# EAGLE design main_board (EAGLE 7.7.0)
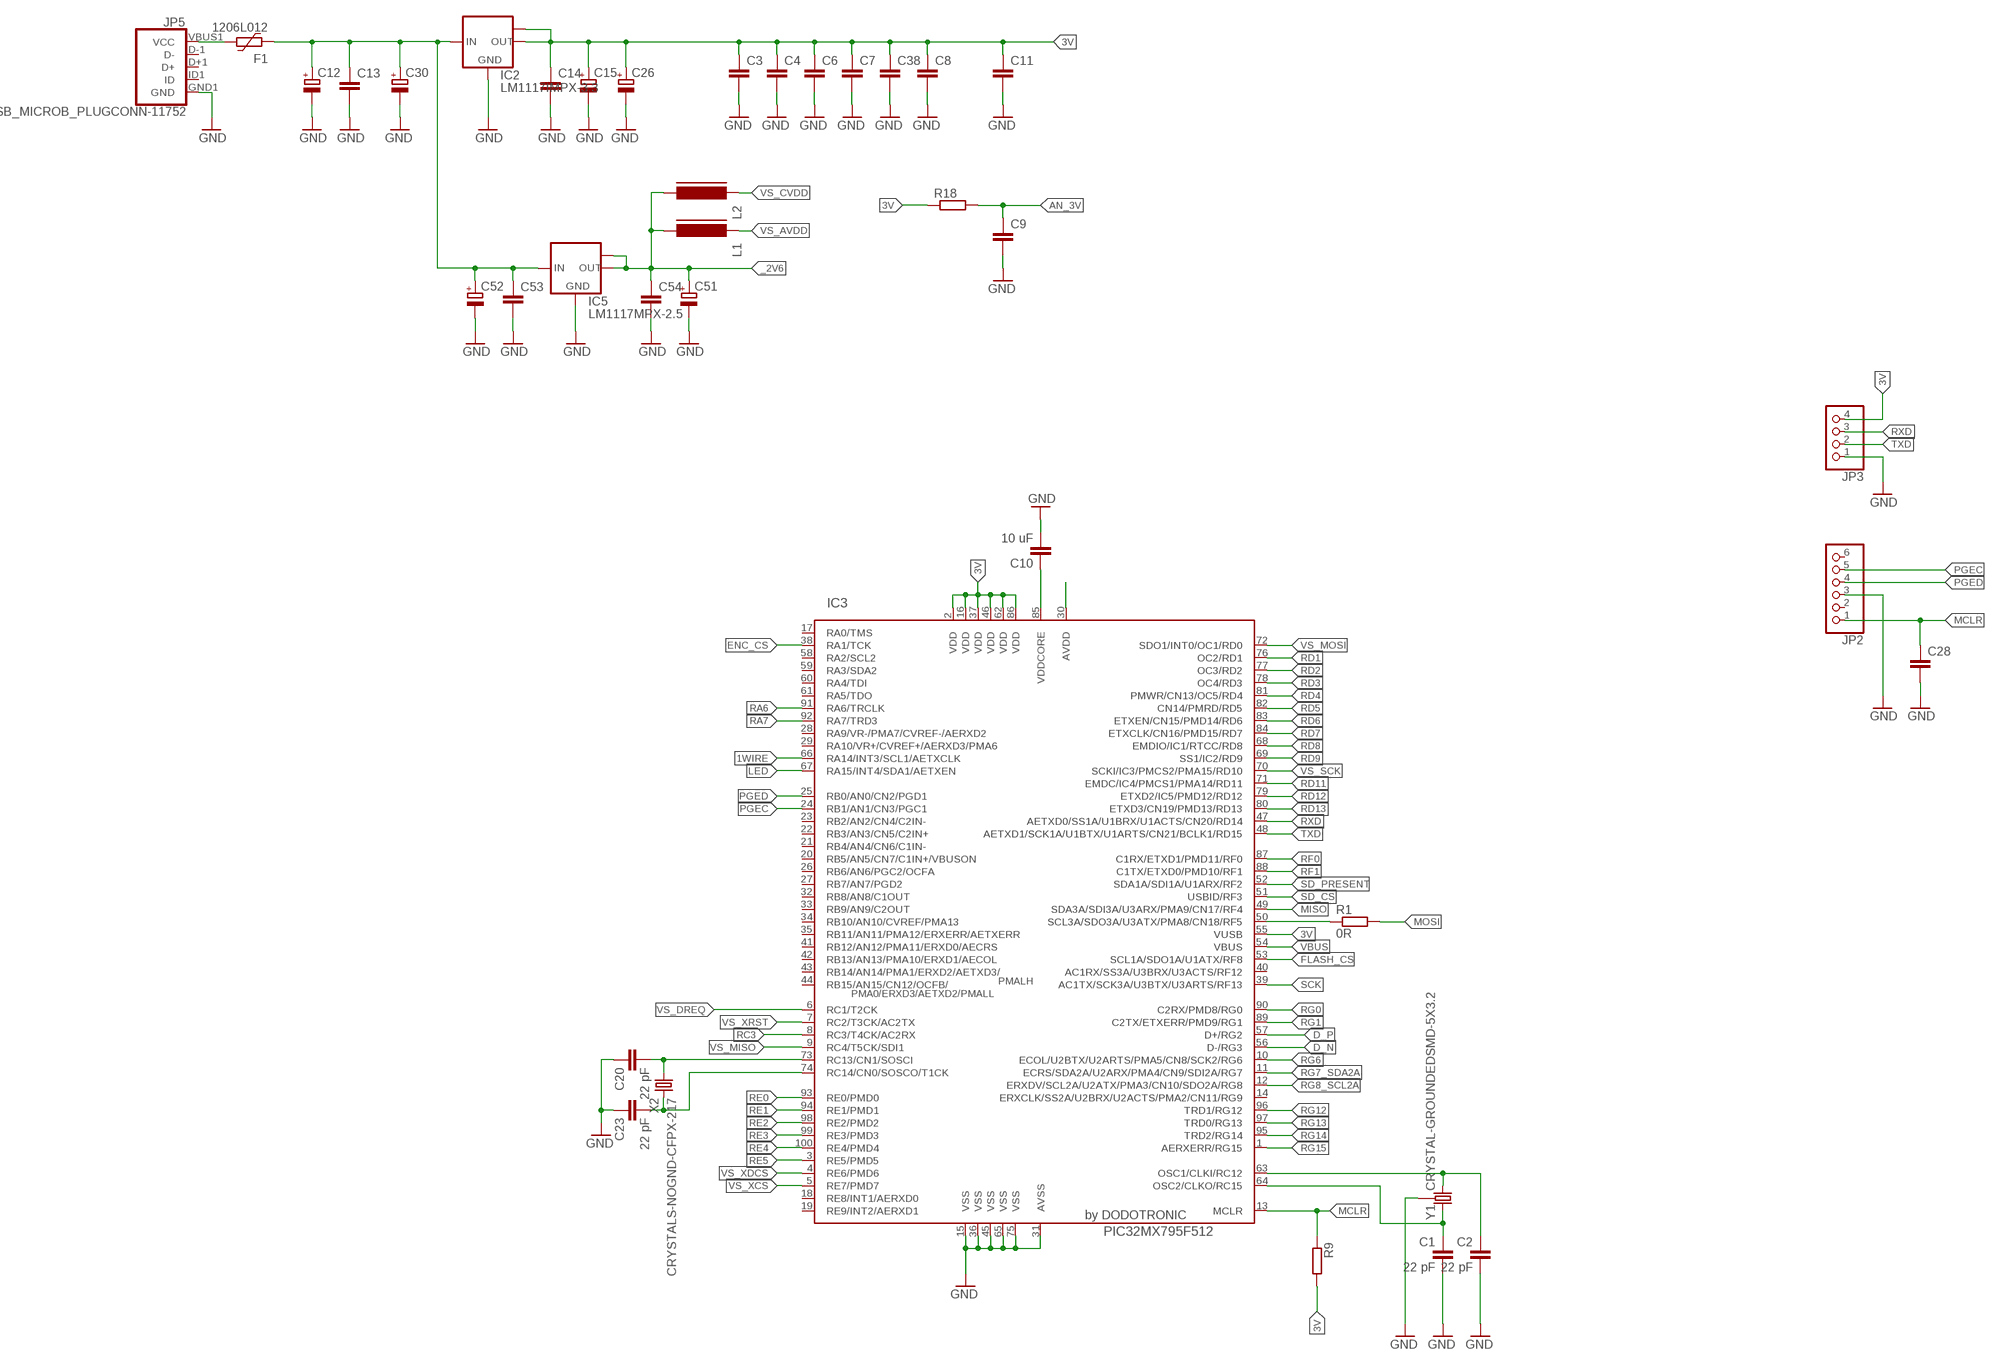
[diagram p0: schematic, sheet 1, part 1 of 3]
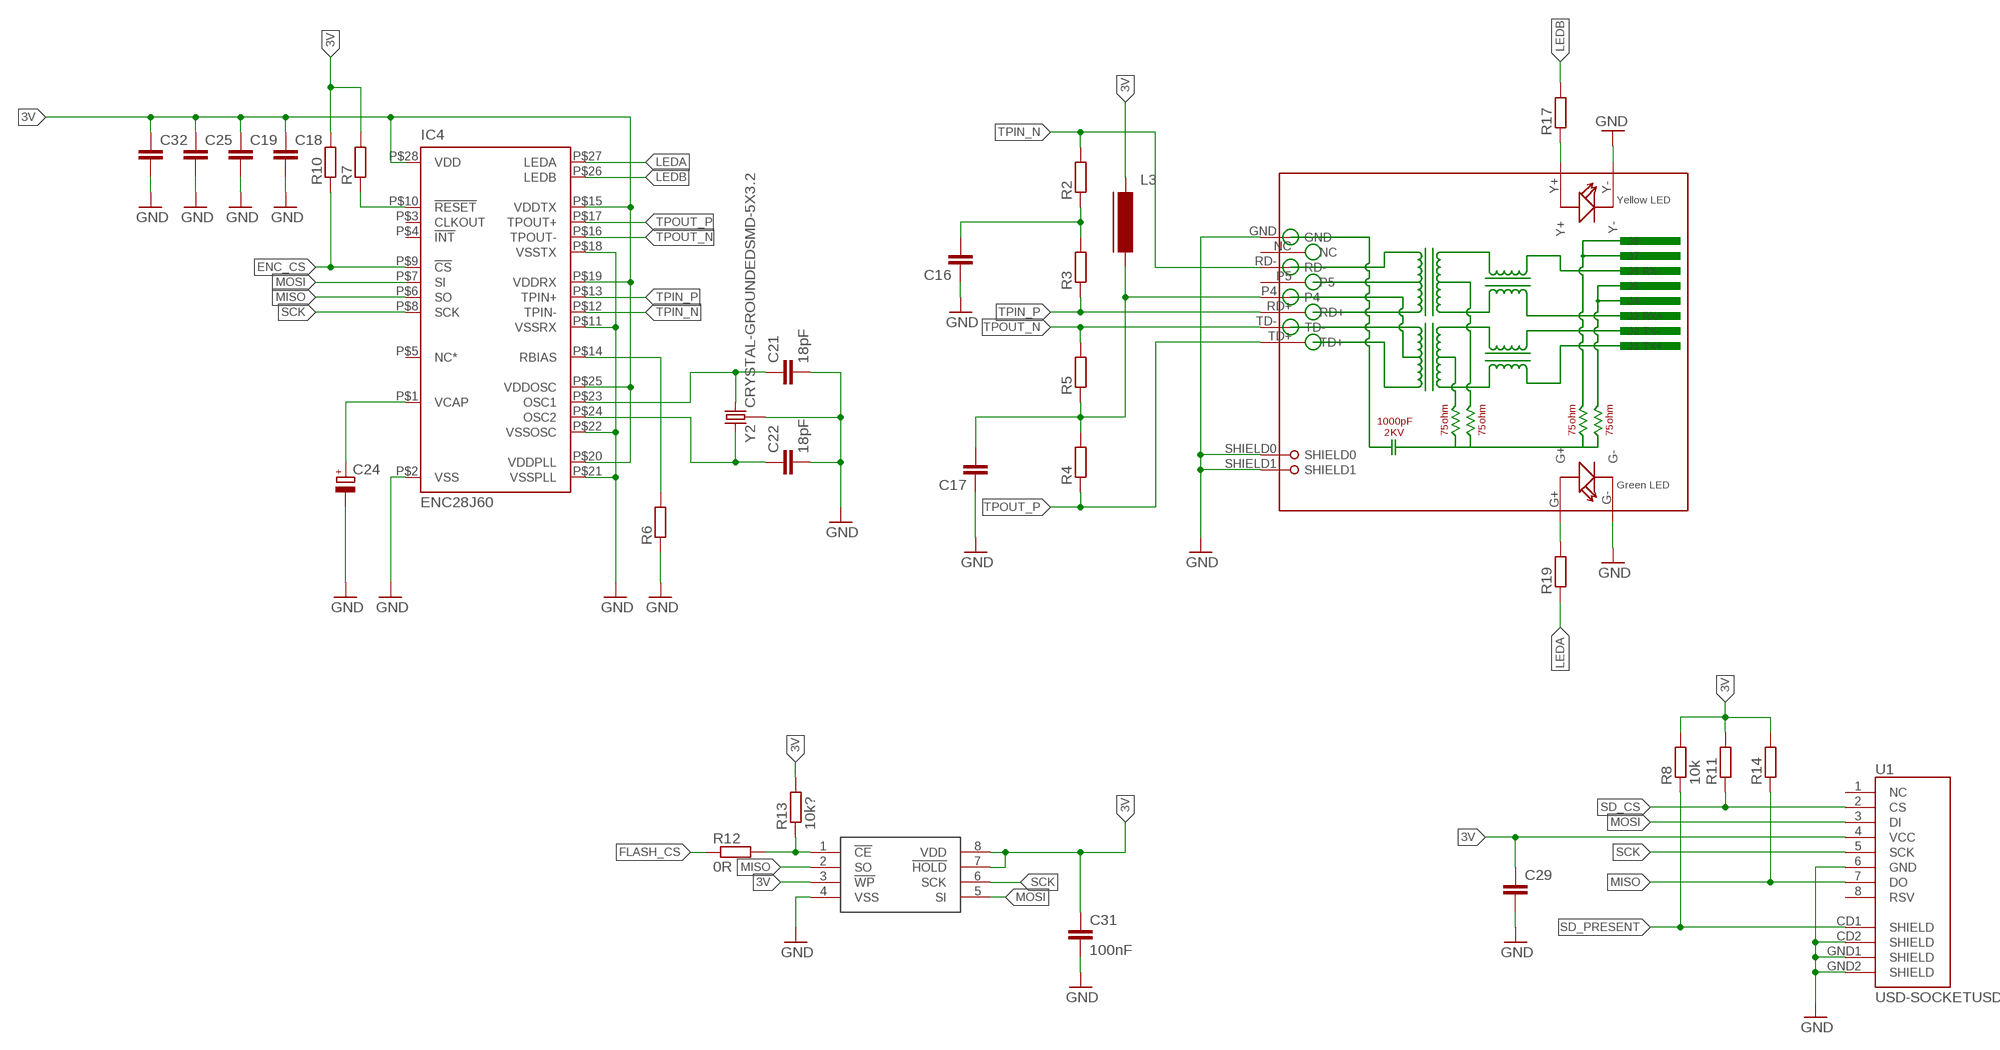
[diagram p1: schematic, sheet 1, part 2 of 3]
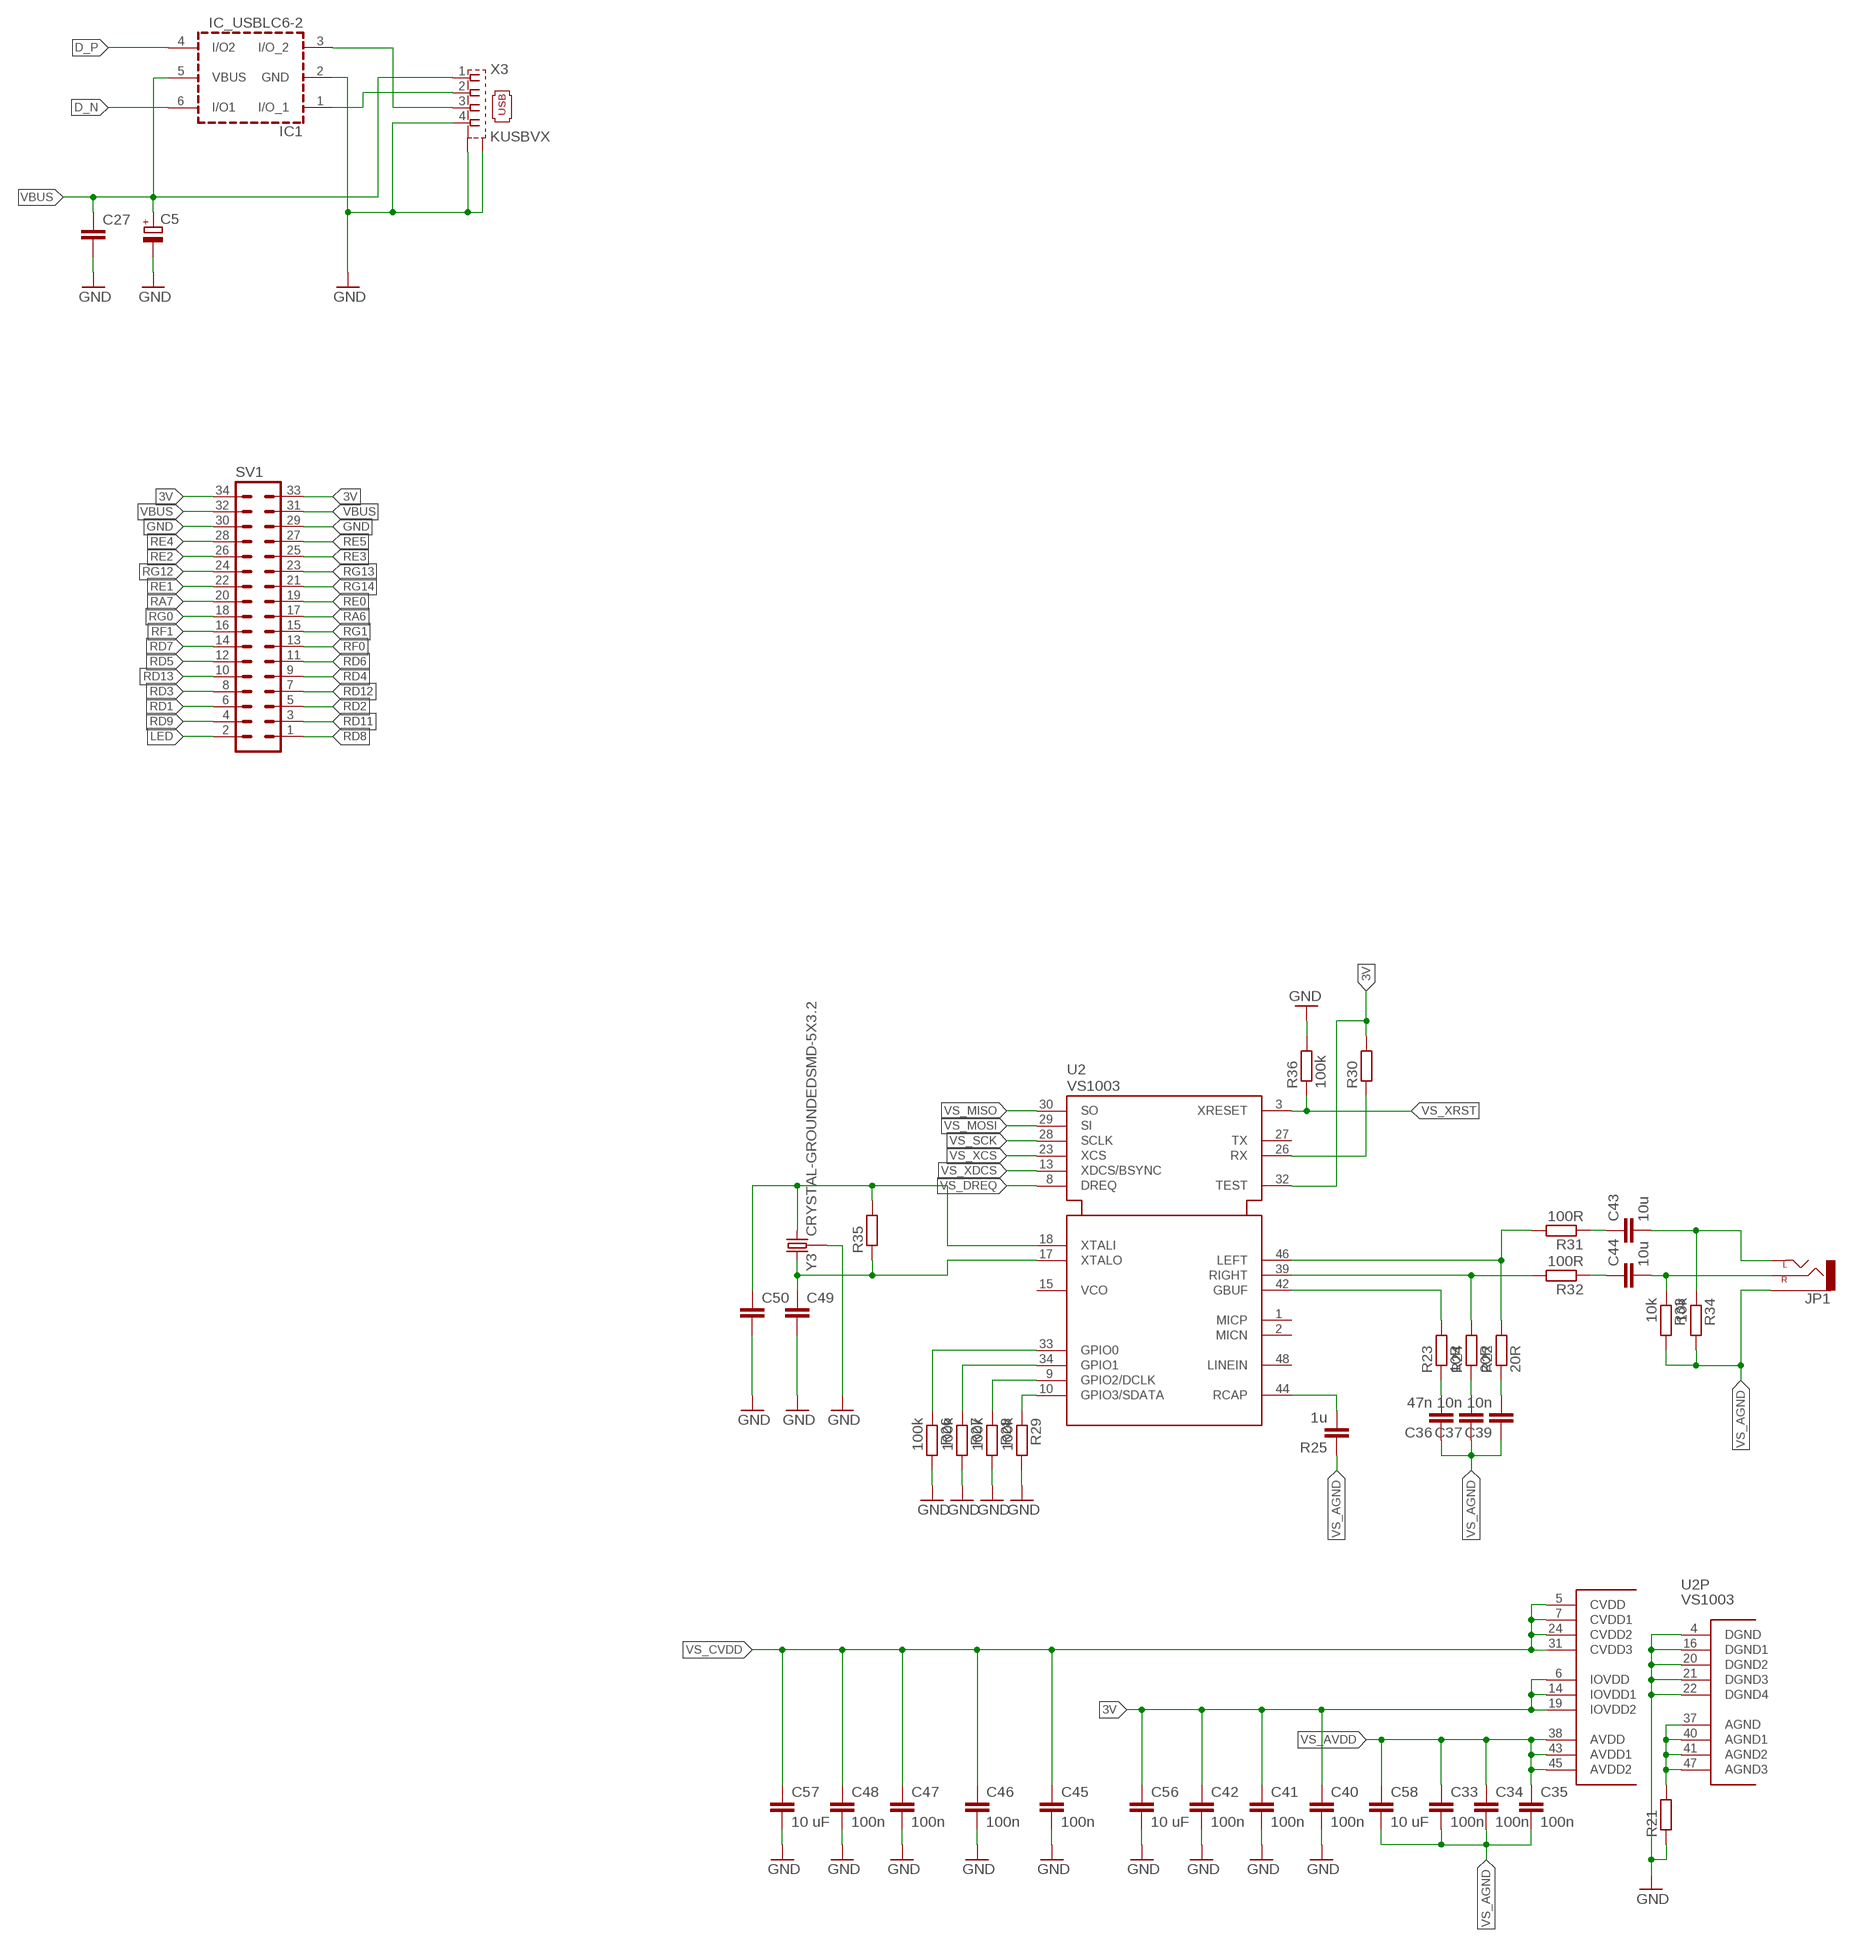
[diagram p2: schematic, sheet 1, part 3 of 3]

## Parts
C1  22 pF  C-EUC0603  [C0603]
C2  22 pF  C-EUC0603  [C0603]
C3  C-EUC0402  [C0402]
C4  C-EUC0402  [C0402]
C5  CPOL-EUSMCA  [SMC_A]
C6  C-EUC0402  [C0402]
C7  C-EUC0402  [C0402]
C8  C-EUC0402  [C0402]
C9  C-EUC0402  [C0402]
C10  10 uF  C-EUC0603  [C0603]
C11  C-EUC0402  [C0402]
C12  CPOL-EUSMCB  [SMC_B]
C13  C-EUC0603  [C0603]
C14  C-EUC0603  [C0603]
C15  CPOL-EUSMCB  [SMC_B]
C16  C-EUC0603  [C0603]
C17  C-EUC0603  [C0603]
C18  C-EUC0402  [C0402]
C19  C-EUC0603  [C0603]
C20  22 pF  C-EUC0603  [C0603]
C21  18pF  C-EUC0603  [C0603]
C22  18pF  C-EUC0603  [C0603]
C23  22 pF  C-EUC0603  [C0603]
C24  CPOL-EUSMCA  [SMC_A]
C25  C-EUC0603  [C0603]
C26  CPOL-EUSMCA  [SMC_A]
C27  C-EUC0603  [C0603]
C28  C-EUC0603  [C0603]
C29  C-EUC0603  [C0603]
C30  CPOL-EUSMCA  [SMC_A]
C31  100nF  C-EUC0603  [C0603]
C32  C-EUC0402  [C0402]
C33  100n  C-EUC0603  [C0603]
C34  100n  C-EUC0603  [C0603]
C35  100n  C-EUC0603  [C0603]
C36  47n  C-EUC0603  [C0603]
C37  10n  C-EUC0603  [C0603]
C38  C-EUC0402  [C0402]
C39  10n  C-EUC0603  [C0603]
C40  100n  C-EUC0402  [C0402]
C41  100n  C-EUC0402  [C0402]
C42  100n  C-EUC0402  [C0402]
C43  10u  C-EUC0603  [C0603]
C44  10u  C-EUC0603  [C0603]
C45  100n  C-EUC0402  [C0402]
C46  100n  C-EUC0603  [C0603]
C47  100n  C-EUC0603  [C0603]
C48  100n  C-EUC0603  [C0603]
C49  C-EUC0603  [C0603]
C50  C-EUC0603  [C0603]
C51  CPOL-EUSMCB  [SMC_B]
C52  CPOL-EUSMCB  [SMC_B]
C53  C-EUC1206  [C1206]
C54  C-EUC1206  [C1206]
C56  10 uF  C-EUC0603  [C0603]
C57  10 uF  C-EUC0603  [C0603]
C58  10 uF  C-EUC0603  [C0603]
F1  1206L012  [1206L]
IC1  IC_USBLC6-2  [SOT-23-6L]
IC2  LM1117IMPX-3.3  [SOT223]
IC3  PIC32MX795F512  [TQFP100_12X12]
IC4  ENC28J60  [TSSOP28W]
IC5  LM1117MPX-2.5  [SOT223]
JP1  AUDIO-JACKAUDIO_JACK2  [AUDIO-JACK2]
JP2  PINHD-1X6  [1X06]
JP3  PINHD-1X4  [1X04]
JP5  USB_MICROB_PLUGCONN-11752  [USB-B-MICRO-SMD_V03]
L1  FERRITE-0805  [FB805]
L2  FERRITE-0805  [FB805]
L3  FERRITE-0805  [FB805]
R1  0R  R-EU_R0603  [R0603]
R2  R-EU_R0603  [R0603]
R3  R-EU_R0603  [R0603]
R4  R-EU_R0603  [R0603]
R5  R-EU_R0603  [R0603]
R6  R-EU_R0805  [R0805]
R7  R-EU_R0402  [R0402]
R8  10k  R-EU_R0603  [R0603]
R9  R-EU_R0603  [R0603]
R10  R-EU_R0603  [R0603]
R11  R-EU_R0603  [R0603]
R12  0R  R-EU_R0603  [R0603]
R13  10k?  R-EU_R0603  [R0603]
R14  R-EU_R0603  [R0603]
R17  R-EU_R1206  [R1206]
R18  R-EU_R0805  [R0805]
R19  R-EU_R1206  [R1206]
R21  R-EU_R0603  [R0603]
R22  20R  R-EU_R0603  [R0603]
R23  10R  R-EU_R0603  [R0603]
R24  20R  R-EU_R0603  [R0603]
R25  1u  C-EUC0603  [C0603]
R26  100k  R-EU_R0402  [R0402]
R27  100k  R-EU_R0402  [R0402]
R28  100k  R-EU_R0402  [R0402]
R29  100k  R-EU_R0402  [R0402]
R30  R-EU_0204/7  [0204/7]
R31  100R  R-EU_R0603  [R0603]
R32  100R  R-EU_R0603  [R0603]
R33  10k  R-EU_R0603  [R0603]
R34  10k  R-EU_R0603  [R0603]
R35  R-EU_R0603  [R0603]
R36  100k  R-EU_R0603  [R0603]
RJ1  HR911105A  [HR911105A]
SV1  ML34L  [ML34L]
U1  USD-SOCKETUSD  [USD-SOCKET-PP]
U2  VS1003  [LQFP48]
U$2  SST25VF016BSO8M  [SO-08M]
X2  CRYSTALS-NOGND-CFPX-217  [3.2X1.5-2-PAD]
X3  KUSBVX  [KUSBVX]
Y1  CRYSTAL-GROUNDEDSMD-5X3.2  [CRYSTAL-SMD-5X3.2-4PAD]
Y2  CRYSTAL-GROUNDEDSMD-5X3.2  [CRYSTAL-SMD-5X3.2-4PAD]
Y3  CRYSTAL-GROUNDEDSMD-5X3.2  [CRYSTAL-SMD-5X3.2-4PAD]

## Nets
1WIRE: IC3.66(RA14/INT3/SCL1/AETXCLK)
3V: C3.1 C4.1 C6.1 C7.1 C8.1 C11.1 C14.1 C15.+ C18.1 C19.1 C25.1 C26.+ C29.1 C31.1 C32.1 C38.1 C40.1 C41.1 C42.1 C56.1 IC2.2(OUT) IC2.TAB(OUT1) IC3.2(VDD) IC3.16(VDD) IC3.37(VDD) IC3.46(VDD) IC3.55(VUSB) IC3.62(VDD) IC3.86(VDD) IC4.P$15(VDDTX) IC4.P$19(VDDRX) IC4.P$20(VDDPLL) IC4.P$25(VDDOSC) IC4.P$28(VDD) JP3.4 L3.1 R7.2 R8.2 R9.2 R10.2 R11.2 R13.2 R14.2 R18.1 R30.2 SV1.33 SV1.34 U1.4(VCC) U2.6(IOVDD) U2.14(IOVDD1) U2.19(IOVDD2) U2.32(TEST) U$2.3(!WP) U$2.7(!HOLD) U$2.8(VDD)
_2V6: C51.+ C54.1 IC5.2(OUT) IC5.TAB(OUT1) L1.2 L2.2
AN_3V: C9.1 IC3.30(AVDD) R18.2
CE1: R12.2 R13.1 U$2.1(!CE)
D2_N: IC1.1(I/O_1) X3.2
D2_P: IC1.3(I/O_2) X3.3
D_N: IC1.6(I/O1) IC3.56(D-/RG3)
D_P: IC1.4(I/O2) IC3.57(D+/RG2)
ENC_CS: IC3.38(RA1/TCK) IC4.P$9(!CS) R10.1
ENC_RST: IC4.P$10(!RESET) R7.1
FLASH_CS: IC3.53(SCL1A/SDO1A/U1ATX/RF8) R12.1
GND: C1.2 C2.2 C3.2 C4.2 C5.- C6.2 C7.2 C8.2 C9.2 C10.2 C11.2 C12.- C13.2 C14.2 C15.- C16.1 C17.1 C18.2 C19.2 C20.1 C21.2 C22.2 C23.1 C24.- C25.2 C26.- C27.2 C28.2 C29.2 C30.- C31.2 C32.2 C38.2 C40.2 C41.2 C42.2 C45.2 C46.2 C47.2 C48.2 C49.2 C50.2 C51.- C52.- C53.2 C54.2 C56.2 C57.2 IC1.2(GND) IC2.1(GND) IC3.15(VSS) IC3.31(AVSS) IC3.36(VSS) IC3.45(VSS) IC3.65(VSS) IC3.75(VSS) IC4.P$2(VSS) IC4.P$11(VSSRX) IC4.P$18(VSSTX) IC4.P$21(VSSPLL) IC4.P$22(VSSOSC) IC5.1(GND) JP2.3 JP3.1 JP5.GND1(GND) R6.1 R21.1 R26.2 R27.2 R28.2 R29.2 R36.2 RJ1.G- RJ1.GND RJ1.SHIELD0 RJ1.SHIELD1 RJ1.Y- SV1.29 SV1.30 U1.6(GND) U1.CD2(SHIELD) U1.GND1(SHIELD) U1.GND2(SHIELD) U2.4(DGND) U2.16(DGND1) U2.20(DGND2) U2.21(DGND3) U2.22(DGND4) U$2.4(VSS) X3.4 X3.M1(S1) X3.M2(S2) Y1.2 Y1.4 Y2.2 Y2.4 Y3.2 Y3.4
LED: IC3.67(RA15/INT4/SDA1/AETXEN) SV1.2
LEDA: IC4.P$27(LEDA) R19.1
LEDB: IC4.P$26(LEDB) R17.2
MCLR: C28.1 IC3.13(MCLR) JP2.1 R9.1
MISO: IC3.49(SDA3A/SDI3A/U3ARX/PMA9/CN17/RF4) IC4.P$6(SO) R14.1 U1.7(DO) U$2.2(SO)
MOSI: IC4.P$7(SI) R1.2 U1.3(DI) U$2.5(SI)
N$2: C16.2 R2.1 R3.2
N$5: IC3.50(SCL3A/SDO3A/U3ATX/PMA8/CN18/RF5) R1.1
N$6: C17.2 L3.2 R4.2 R5.1 RJ1.P4
N$10: C10.1 IC3.85(VDDCORE)
N$12: IC4.P$14(RBIAS) R6.2
N$17: F1.1 JP5.VBUS1(VCC)
N$18: C36.2 R23.1
N$22: C21.1 IC4.P$23(OSC1) Y2.1
N$23: C22.1 IC4.P$24(OSC2) Y2.3
N$29: C24.+ IC4.P$1(VCAP)
N$30: R17.1 RJ1.Y+
N$31: R19.2 RJ1.G+
OSC1: C2.1 IC3.63(OSC1/CLKI/RC12) Y1.1
OSC2: C1.1 IC3.64(OSC2/CLKO/RC15) Y1.3
PGEC: IC3.24(RB1/AN1/CN3/PGC1) JP2.5
PGED: IC3.25(RB0/AN0/CN2/PGD1) JP2.4
RA6: IC3.91(RA6/TRCLK) SV1.17
RA7: IC3.92(RA7/TRD3) SV1.20
RC3: IC3.8(RC3/T4CK/AC2RX)
RD1: IC3.76(OC2/RD1) SV1.6
RD2: IC3.77(OC3/RD2) SV1.5
RD3: IC3.78(OC4/RD3) SV1.8
RD4: IC3.81(PMWR/CN13/OC5/RD4) SV1.9
RD5: IC3.82(CN14/PMRD/RD5) SV1.12
RD6: IC3.83(ETXEN/CN15/PMD14/RD6) SV1.11
RD7: IC3.84(ETXCLK/CN16/PMD15/RD7) SV1.14
RD8: IC3.68(EMDIO/IC1/RTCC/RD8) SV1.1
RD9: IC3.69(SS1/IC2/RD9) SV1.4
RD11: IC3.71(EMDC/IC4/PMCS1/PMA14/RD11) SV1.3
RD12: IC3.79(ETXD2/IC5/PMD12/RD12) SV1.7
RD13: IC3.80(ETXD3/CN19/PMD13/RD13) SV1.10
RE0: IC3.93(RE0/PMD0) SV1.19
RE1: IC3.94(RE1/PMD1) SV1.22
RE2: IC3.98(RE2/PMD2) SV1.26
RE3: IC3.99(RE3/PMD3) SV1.25
RE4: IC3.100(RE4/PMD4) SV1.28
RE5: IC3.3(RE5/PMD5) SV1.27
RF0: IC3.87(C1RX/ETXD1/PMD11/RF0) SV1.13
RF1: IC3.88(C1TX/ETXD0/PMD10/RF1) SV1.16
RG0: IC3.90(C2RX/PMD8/RG0) SV1.18
RG1: IC3.89(C2TX/ETXERR/PMD9/RG1) SV1.15
RG6: IC3.10(ECOL/U2BTX/U2ARTS/PMA5/CN8/SCK2/RG6)
RG7_SDA2A: IC3.11(ECRS/SDA2A/U2ARX/PMA4/CN9/SDI2A/RG7)
RG8_SCL2A: IC3.12(ERXDV/SCL2A/U2ATX/PMA3/CN10/SDO2A/RG8)
RG12: IC3.96(TRD1/RG12) SV1.24
RG13: IC3.97(TRD0/RG13) SV1.23
RG14: IC3.95(TRD2/RG14) SV1.21
RG15: IC3.1(AERXERR/RG15)
RXD: IC3.47(AETXD0/SS1A/U1BRX/U1ACTS/CN20/RD14) JP3.3
SCK: IC3.39(AC1TX/SCK3A/U3BTX/U3ARTS/RF13) IC4.P$8(SCK) U1.5(SCK) U$2.6(SCK)
SD_CS: IC3.51(USBID/RF3) R11.1 U1.2(CS)
SD_PRESENT: IC3.52(SDA1A/SDI1A/U1ARX/RF2) R8.1 U1.CD1(SHIELD)
SOSCI: C20.2 IC3.73(RC13/CN1/SOSCI) X2.1
SOSCO: C23.2 IC3.74(RC14/CN0/SOSCO/T1CK) X2.2
TPIN_N: IC4.P$12(TPIN-) R2.2 RJ1.RD-
TPIN_P: IC4.P$13(TPIN+) R3.1 RJ1.RD+
TPOUT_N: IC4.P$16(TPOUT-) R5.2 RJ1.TD-
TPOUT_P: IC4.P$17(TPOUT+) R4.1 RJ1.TD+
TXD: IC3.48(AETXD1/SCK1A/U1BTX/U1ARTS/CN21/BCLK1/RD15) JP3.2
VBUS: C5.+ C12.+ C13.1 C27.1 C30.+ C52.+ C53.1 F1.2 IC1.5(VBUS) IC2.3(IN) IC3.54(VBUS) IC5.3(IN) SV1.31 SV1.32 X3.1
VS_AGND: C33.2 C34.2 C35.2 C36.1 C37.1 C39.1 C58.2 JP1.SLEEVE R21.2 R25.1 R33.2 R34.2 U2.37(AGND) U2.40(AGND1) U2.41(AGND2) U2.47(AGND3)
VS_AVDD: C33.1 C34.1 C35.1 C58.1 L1.1 U2.38(AVDD) U2.43(AVDD1) U2.45(AVDD2)
VS_CVDD: C45.1 C46.1 C47.1 C48.1 C57.1 L2.1 U2.5(CVDD) U2.7(CVDD1) U2.24(CVDD2) U2.31(CVDD3)
VS_DREQ: IC3.6(RC1/T2CK) U2.8(DREQ)
VS_MISO: IC3.9(RC4/T5CK/SDI1) U2.30(SO)
VS_MOSI: IC3.72(SDO1/INT0/OC1/RD0) U2.29(SI)
VS_N$9: C50.1 R35.2 U2.18(XTALI) Y3.1
VS_N$13: C49.1 R35.1 U2.17(XTALO) Y3.3
VS_N$14: R22.2 R31.2 U2.46(LEFT)
VS_N$15: R23.2 U2.42(GBUF)
VS_N$16: R24.2 R32.2 U2.39(RIGHT)
VS_N$17: R25.2 U2.44(RCAP)
VS_N$24: C37.2 R24.1
VS_N$25: C39.2 R22.1
VS_N$26: R29.1 U2.10(GPIO3/SDATA)
VS_N$27: R28.1 U2.9(GPIO2/DCLK)
VS_N$28: R27.1 U2.34(GPIO1)
VS_N$30: R26.1 U2.33(GPIO0)
VS_N$34: R30.1 U2.26(RX)
VS_N$35: C43.1 R31.1
VS_N$36: C44.1 R32.1
VS_N$37: C44.2 JP1.RING(RIGHT) R33.1
VS_N$38: C43.2 JP1.TIP(LEFT) R34.1
VS_SCK: IC3.70(SCKI/IC3/PMCS2/PMA15/RD10) U2.28(SCLK)
VS_XCS: IC3.5(RE7/PMD7) U2.23(XCS)
VS_XDCS: IC3.4(RE6/PMD6) U2.13(XDCS/BSYNC)
VS_XRST: IC3.7(RC2/T3CK/AC2TX) R36.1 U2.3(XRESET)
Unconnected: IC3.14(ERXCLK/SS2A/U2BRX/U2ACTS/PMA2/CN11/RG9) IC3.17(RA0/TMS) IC3.18(RE8/INT1/AERXD0) IC3.19(RE9/INT2/AERXD1) IC3.20(RB5/AN5/CN7/C1IN+/VBUSON) IC3.21(RB4/AN4/CN6/C1IN-) IC3.22(RB3/AN3/CN5/C2IN+) IC3.23(RB2/AN2/CN4/C2IN-) IC3.26(RB6/AN6/PGC2/OCFA) IC3.27(RB7/AN7/PGD2) IC3.28(RA9/VR-/PMA7/CVREF-/AERXD2) IC3.29(RA10/VR+/CVREF+/AERXD3/PMA6) IC3.32(RB8/AN8/C1OUT) IC3.33(RB9/AN9/C2OUT) IC3.34(RB10/AN10/CVREF/PMA13) IC3.35(RB11/AN11/PMA12/ERXERR/AETXERR) IC3.40(AC1RX/SS3A/U3BRX/U3ACTS/RF12) IC3.41(RB12/AN12/PMA11/ERXD0/AECRS) IC3.42(RB13/AN13/PMA10/ERXD1/AECOL) IC3.43(RB14/AN14/PMA1/ERXD2/AETXD3/) IC3.44(RB15/AN15/CN12/OCFB/) IC3.58(RA2/SCL2) IC3.59(RA3/SDA2) IC3.60(RA4/TDI) IC3.61(RA5/TDO) IC4.P$3(CLKOUT) IC4.P$4(!INT) IC4.P$5(NC*) JP2.2 JP2.6 JP5.D+1(D+) JP5.D-1(D-) JP5.ID1(ID) RJ1.NC RJ1.P5 U1.1(NC) U1.8(RSV) U2.1(MICP) U2.2(MICN) U2.15(VCO) U2.27(TX) U2.48(LINEIN)

## Library data of the parts
C1-C4 C6-C11 C13 C14 C16-C23 C25 C27-C29 C31-C50 C53 C54 C56-C58 R25 = rcl:C-EU: CAPACITOR, European symbol
C5 C12 C15 C24 C26 C30 C51 C52 = rcl:CPOL-EU: POLARIZED CAPACITOR, European symbol
F1 = polyfuse-smd_10:?: Polyfuse Resettable PTC Source: http://www.littelfuse.com/products/resettable-ptcs.aspx; MF: Littelfuse; MPN: 1206L012; OC_FARNELL: 1596988; OC_NEWARK: 05M2298
IC1 = dp_devices:IC_USBLC6-2
IC2 = lm1117:LM1117IMPX-*
IC3 = DodoMicroR3:PIC32MX795F512: USB, CAN and Ethernet 32-bit Flash Microcontroller
IC4 = microchip:ENC28J60: Stand-Alone Ethernet Controller with SPI Interface Source: http://ww1.microchip.com/downloads/en/DeviceDoc/39662c.pdf
IC5 = lm1117:LM1117MPX-*
JP1 = SparkFun-Connectors:AUDIO-JACK: 3.5mm Audio Jack Simple 3.5mm common PCB mount audio jack. SKU: PRT-08032
JP2 = pinhead:PINHD-1X6: PIN HEADER
JP3 = pinhead:PINHD-1X4: PIN HEADER
JP5 = SparkFun-Connectors:USB_MICROB_PLUG: USB Micro-B connectors Some male, some female. Watch your step!; PROD_ID: CONN-11752
L1-L3 = dp_devices:FERRITE: Ferrite bead in various packages
R1-R14 R17-R19 R21-R24 R26-R36 = rcl:R-EU_: RESISTOR, European symbol
RJ1 = hanrun:HR911105A
SV1 = con-harting-ml:ML34: HARTING; OC_FARNELL: unknown; OC_NEWARK: unknown
U1 = SparkFun-Connectors:USD-SOCKET: microSD Socket Push-push type uSD socket. Schematic element and footprint production proven. Spark Fun Electronics SKU : PRT-00127. tDoc lines correctly indicate media card edge positions when inserting (unlocked, locked, depressed).
U2 = vlsi-web:VS1003: MP3 / WMA / MIDI Audio Codec Circuit
U$2 = mw:SST25VF016B
X2 = IQD-Frequency-Products:CRYSTALS-NOGND: CRYSTALS CAN NOT GROUNDED
X3 = con-kycon:KUSBVX: Vertical,Top Entry Universal Serial Bus Connector KUSBVX Series Source: KYCON Sibalco USB vertical socket KUSBV.pdf
Y1-Y3 = SparkFun-Clocks:CRYSTAL-GROUNDED: Crystals w/ Ground Pin (Generic) These are passive quartz crystals, which can be used as a clock source for a microcontroller. Crystal's are usually two-terminal devices. A third terminal may be optionally connected to ground, as recommended by the manufaturer.

## Board
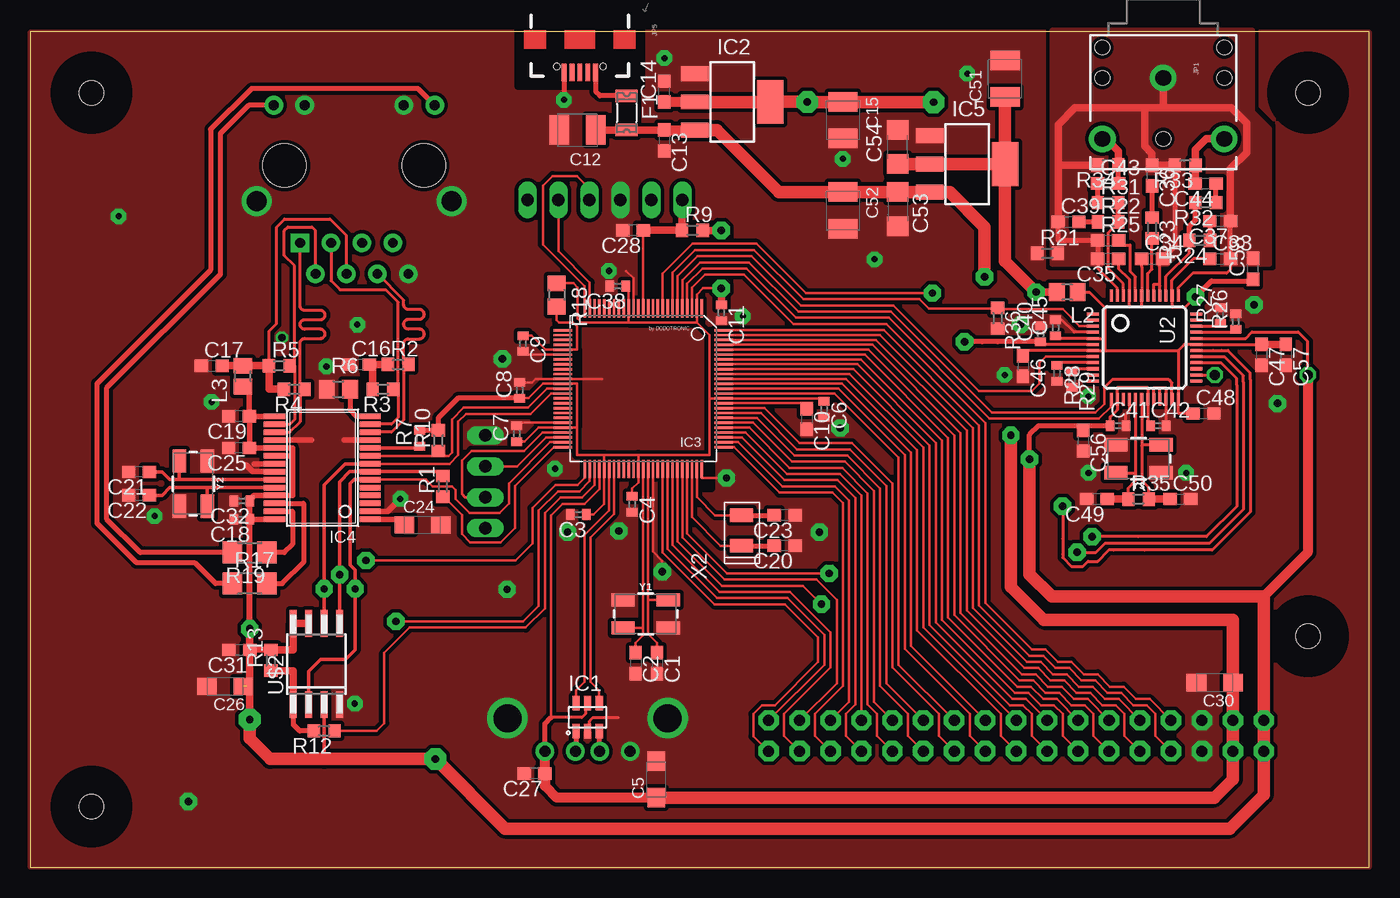
[diagram p3: board, top side]
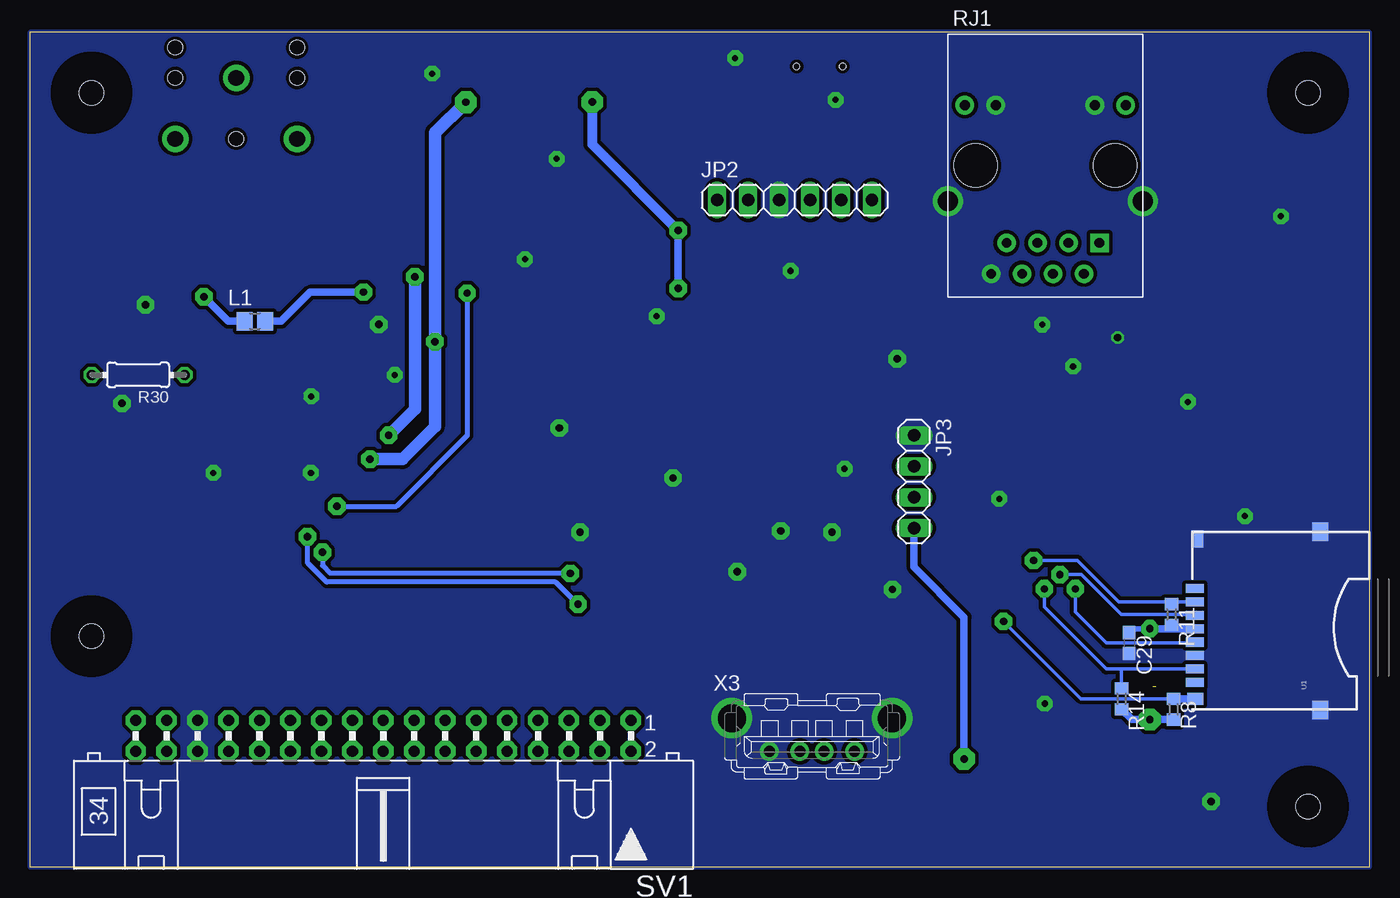
[diagram p4: board, bottom side, seen from below]

Size 109.86 x 68.58 mm. Coordinates in mm from the lower left corner, seen from the top.
Outline: 0,0 109.86,0 109.86,68.58 0,68.58 0,0
Copper layers (1*16): Top 0.035mm / dielectric 1.5mm / Bottom 0.035mm
Design rules "default *": minimum track width 10mil, minimum drill 24mil, track to track 8mil, track to pad 8mil, pad to pad 8mil, via to via 8mil, smd to smd 8mil, copper to edge 0mil, drill to drill 8mil, minimum pad ring 10mil, minimum via ring 8mil, stop-mask expansion 4mil, vias tented up to drill 0mil, thermal gap 10mil
Holes 2 mm at 5,5 104.86,18.97 104.86,63.58 5,63.58
tRestrict: area 55.1,31.1 to 55.9,33.9; area 44.5,11.4 to 47,13.3; area 19.1,28.3 to 20.9,37.3; area 27,28.3 to 28.8,37.3; area 41.3,36.8 to 43.2,37.5; area 48,61 to 49.8,62.8; area 40,64.1 to 50.2,68.6; area 2,2 to 8,8; area 101.8,15.9 to 107.9,22; area 101.8,60.5 to 107.9,66.6; area 2,60.5 to 8,66.6; area 88.5,46.4 to 94.3,47.4; 3 more areas
bRestrict: area 2,2 to 8,8; area 101.8,15.9 to 107.9,22; area 101.8,60.5 to 107.9,66.6; area 2,60.5 to 8,66.6

### Footprints (pad centres in the part's own frame; a part is rotated, then mirrored left to right if it is on the bottom)
C0603 = smd 1.1 x 1: 1 -0.85,0; 2 0.85,0
C0402 = smd 0.7 x 0.9: 1 -0.65,0; 2 0.65,0
SMC_A = smd 1.6 x 1.4: + -1.5,0; - 1.5,0
SMC_B = smd 1.6 x 2.4: + -1.5,0; - 1.5,0
C1206 = smd 1.6 x 1.8: 1 -1.4,0; 2 1.4,0
1206L = smd 1 x 1.8: 1 -1.4,0; 2 1.4,0
SOT-23-6L = smd 0.6 x 1.2: 1 -0.95,-2.3; 2 0,-2.3; 3 0.95,-2.3; 4 0.95,0; 5 0,0; 6 -0.95,0
SOT223 = smd 1.219 x 2.235: 1 -2.311,-3.099; 2 0,-3.099; 3 2.311,-3.099 | smd 3.6 x 2.2: TAB 0,3.099
TQFP100_12X12 = smd 0.2 x 1.5: 1 -4.8,-6.6; 2 -4.4,-6.6; 3 -4,-6.6; 4 -3.6,-6.6; 5 -3.2,-6.6; 6 -2.8,-6.6; 7 -2.4,-6.6; 8 -2,-6.6; 9 -1.6,-6.6; 10 -1.2,-6.6; 11 -0.8,-6.6; 12 -0.4,-6.6; 13 0,-6.6; 14 0.4,-6.6; 15 0.8,-6.6; 16 1.2,-6.6; 17 1.6,-6.6; 18 2,-6.6; 19 2.4,-6.6; 20 2.8,-6.6; 21 3.2,-6.6; 22 3.6,-6.6; 23 4,-6.6; 24 4.4,-6.6; 25 4.8,-6.6; 51 4.8,6.6; 52 4.4,6.6; 53 4,6.6; 54 3.6,6.6; 55 3.2,6.6; 56 2.8,6.6; 57 2.4,6.6; 58 2,6.6; 59 1.6,6.6; 60 1.2,6.6; 61 0.8,6.6; 62 0.4,6.6; 63 0,6.6; 64 -0.4,6.6; 65 -0.8,6.6; 66 -1.2,6.6; 67 -1.6,6.6; 68 -2,6.6; 69 -2.4,6.6; 70 -2.8,6.6; 71 -3.2,6.6; 72 -3.6,6.6; 73 -4,6.6; 74 -4.4,6.6; 75 -4.8,6.6 | smd 1.5 x 0.2: 26 6.6,-4.8; 27 6.6,-4.4; 28 6.6,-4; 29 6.6,-3.6; 30 6.6,-3.2; 31 6.6,-2.8; 32 6.6,-2.4; 33 6.6,-2; 34 6.6,-1.6; 35 6.6,-1.2; 36 6.6,-0.8; 37 6.6,-0.4; 38 6.6,0; 39 6.6,0.4; 40 6.6,0.8; 41 6.6,1.2; 42 6.6,1.6; 43 6.6,2; 44 6.6,2.4; 45 6.6,2.8; 46 6.6,3.2; 47 6.6,3.6; 48 6.6,4; 49 6.6,4.4; 50 6.6,4.8; 76 -6.6,4.8; 77 -6.6,4.4; 78 -6.6,4; 79 -6.6,3.6; 80 -6.6,3.2; 81 -6.6,2.8; 82 -6.6,2.4; 83 -6.6,2; 84 -6.6,1.6; 85 -6.6,1.2; 86 -6.6,0.8; 87 -6.6,0.4; 88 -6.6,0; 89 -6.6,-0.4; 90 -6.6,-0.8; 91 -6.6,-1.2; 92 -6.6,-1.6; 93 -6.6,-2; 94 -6.6,-2.4; 95 -6.6,-2.8; 96 -6.6,-3.2; 97 -6.6,-3.6; 98 -6.6,-4; 99 -6.6,-4.4; 100 -6.6,-4.8
TSSOP28W = smd 0.45 x 1.75: P$1 0,-0.65; P$2 0.65,-0.65; P$3 1.3,-0.65; P$4 1.95,-0.65; P$5 2.6,-0.65; P$6 3.25,-0.65; P$7 3.9,-0.65; P$8 4.55,-0.65; P$9 5.2,-0.65; P$10 5.85,-0.65; P$11 6.5,-0.65; P$12 7.15,-0.65; P$13 7.8,-0.65; P$14 8.45,-0.65; P$15 8.45,7.2; P$16 7.8,7.2; P$17 7.15,7.2; P$18 6.5,7.2; P$19 5.85,7.2; P$20 5.2,7.2; P$21 4.55,7.2; P$22 3.9,7.2; P$23 3.25,7.2; P$24 2.6,7.2; P$25 1.95,7.2; P$26 1.3,7.2; P$27 0.65,7.2; P$28 0,7.2
AUDIO-JACK2 = drill 1.3 pad 2.184: RING 5,5; SLEEVE 0,0; TIP 5,-5 | hole 1.2: 0,5; -2.5,5; -2.5,-5; 0,-5; 5,0
1X06 = drill 1.016 long: 1 -6.35,0; 2 -3.81,0; 3 -1.27,0; 4 1.27,0; 5 3.81,0; 6 6.35,0
1X04 = drill 1.016 long: 1 -3.81,0; 2 -1.27,0; 3 1.27,0; 4 3.81,0
USB-B-MICRO-SMD_V03 = smd 1.4 x 0.4: D+1 2.7,0; D-1 2.7,0.65; GND1 2.7,-1.3; ID1 2.7,-0.65; VBUS1 2.7,1.3 | hole 0.5: 2.2,1.9; 2.2,-1.9
FB805 = smd 1.3 x 1.5: 1 -0.85,0; 2 0.85,0
R0603 = smd 1 x 1.1: 1 -0.85,0; 2 0.85,0
R0805 = smd 1.3 x 1.5: 1 -0.95,0; 2 0.95,0
R0402 = smd 0.7 x 0.9: 1 -0.65,0; 2 0.65,0
R1206 = smd 1.6 x 1.803: 1 -1.422,0; 2 1.422,0
0204/7 = drill 0.813 octagon: 1 -3.81,0; 2 3.81,0
HR911105A = drill 0.813 pad 1.524: G+ 4.953,-6.604; G- 4.953,-4.064; GND -8.89,4.445; NC -6.35,3.175; P4 -8.89,-0.635; P5 -6.35,0.635; RD+ -6.35,-1.905; RD- -8.89,1.905; TD- -8.89,-3.175; Y+ 4.953,6.604; Y- 4.953,4.064 | drill 1.651 pad 2.159: SHIELD0 -2.921,8.001; SHIELD1 -2.921,-8.001 | drill 0.813 pad 1.524 square: TD+ -6.35,-4.445 | hole 3.556: 0,-5.715; 0,5.715
ML34L = drill 0.914 pad 1.676 octagon: 1 -20.32,-1.27; 2 -20.32,1.27; 3 -17.78,-1.27; 4 -17.78,1.27; 5 -15.24,-1.27; 6 -15.24,1.27; 7 -12.7,-1.27; 8 -12.7,1.27; 9 -10.16,-1.27; 10 -10.16,1.27; 11 -7.62,-1.27; 12 -7.62,1.27; 13 -5.08,-1.27; 14 -5.08,1.27; 15 -2.54,-1.27; 16 -2.54,1.27; 17 0,-1.27; 18 0,1.27; 19 2.54,-1.27; 20 2.54,1.27; 21 5.08,-1.27; 22 5.08,1.27; 23 7.62,-1.27; 24 7.62,1.27; 25 10.16,-1.27; 26 10.16,1.27; 27 12.7,-1.27; 28 12.7,1.27; 29 15.24,-1.27; 30 15.24,1.27; 31 17.78,-1.27; 32 17.78,1.27; 33 20.32,-1.27; 34 20.32,1.27
USD-SOCKET-PP = smd 0.75 x 1.5: 1 3.2,14.3; 2 2.1,14.3; 3 1,14.3; 4 -0.1,14.3; 5 -1.2,14.3; 6 -2.3,14.3; 7 -3.4,14.3; 8 -4.5,14.3 | smd 1 x 1.3: CD1 -5.85,14.25 | smd 1.4 x 1: CD2 7.275,14.1 | smd 1.5 x 1.35: GND1 -6.775,4; GND2 7.875,4
LQFP48 = smd 0.25 x 1: 1 -2.75,-4.25; 2 -2.25,-4.25; 3 -1.75,-4.25; 4 -1.25,-4.25; 5 -0.75,-4.25; 6 -0.25,-4.25; 7 0.25,-4.25; 8 0.75,-4.25; 9 1.25,-4.25; 10 1.75,-4.25; 11 2.25,-4.25; 12 2.75,-4.25; 25 2.75,4.25; 26 2.25,4.25; 27 1.75,4.25; 28 1.25,4.25; 29 0.75,4.25; 30 0.25,4.25; 31 -0.25,4.25; 32 -0.75,4.25; 33 -1.25,4.25; 34 -1.75,4.25; 35 -2.25,4.25; 36 -2.75,4.25 | smd 1 x 0.25: 13 4.25,-2.75; 14 4.25,-2.25; 15 4.25,-1.75; 16 4.25,-1.25; 17 4.25,-0.75; 18 4.25,-0.25; 19 4.25,0.25; 20 4.25,0.75; 21 4.25,1.25; 22 4.25,1.75; 23 4.25,2.25; 24 4.25,2.75; 37 -4.25,2.75; 38 -4.25,2.25; 39 -4.25,1.75; 40 -4.25,1.25; 41 -4.25,0.75; 42 -4.25,0.25; 43 -4.25,-0.25; 44 -4.25,-0.75; 45 -4.25,-1.25; 46 -4.25,-1.75; 47 -4.25,-2.25; 48 -4.25,-2.75
SO-08M = smd 0.6 x 2.2: 1 -1.905,-3.33; 2 -0.635,-3.33; 3 0.635,-3.33; 4 1.905,-3.33; 5 1.905,3.33; 6 0.635,3.33; 7 -0.635,3.33; 8 -1.905,3.33
3.2X1.5-2-PAD = smd 1.1 x 1.9: 1 -1.25,0; 2 1.25,0
KUSBVX = drill 0.9 pad 1.524: 1 3.5,0; 2 1,0; 3 -1,0; 4 -3.5,0 | drill 2.3 pad 2.8: M1 -6.57,2.71; M2 6.57,2.71
CRYSTAL-SMD-5X3.2-4PAD = smd 1.9 x 1.1: 1 -1.85,-1.15; 2 1.85,-1.15; 3 1.85,1.15; 4 -1.85,1.15

### Placement (x,y rotation side)
C1  51.43,16.76 270 top
C2  49.66,16.76 270 top
C3  44.96,28.96 180 top
C4  49.38,29.81 270 top
C5  51.36,7.21 90 top
C6  65.13,37.6 270 top
C7  39.9,35.59 90 top
C8  40.16,39.15 90 top
C9  40.41,42.99 270 top
C10  63.7,36.8 270 top
C11  56.69,45.53 270 top
C12  44.91,60.53 180 top
C13  52.02,59.66 270 top
C14  52.02,63.68 90 top
C15  66.67,61.34 270 top
C16  26.97,41.27 0 top
C17  14.88,41.17 0 top
C18  17.35,28.57 180 top
C19  17.12,37.02 180 top
C20  61.9,26.4 180 top
C21  8.92,32.46 180 top
C22  8.92,30.54 180 top
C23  61.9,28.9 180 top
C24  32.17,28.1 0 top
C25  17.11,34.43 180 top
C26  15.98,14.86 180 top
C27  41.37,7.7 180 top
C28  49.45,52.29 180 top
C29  19.68,18.41 270 bottom
C30  97.18,15.16 180 top
C31  17.14,17.84 180 top
C32  17.35,30.07 180 top
C33  97.64,49.95 0 top
C34  92.05,49.95 0 top
C35  88.44,49.95 180 top
C36  92.05,56.78 270 top
C37  97.64,53.04 180 top
C38  48.19,47.71 180 top
C39  85.19,52.98 0 top
C40  82.9,43.8 90 top
C41  89.26,36.25 0 top
C42  92.56,36.25 0 top
C43  88.44,56.13 0 top
C44  96.44,56.12 180 top
C45  84.12,44.3 90 top
C46  81.46,41.15 270 top
C47  101.04,42.07 270 top
C48  96.27,37.26 0 top
C49  87.51,30.23 180 top
C50  94.37,30.23 0 top
C51  79.98,64.74 90 top
C52  66.67,53.92 270 top
C53  71.17,54.03 270 top
C54  71.17,59.13 90 top
C56  86.39,35.03 270 top
C57  103.02,42.07 270 top
C58  100.33,49.12 90 top
F1  48.92,61.93 270 top
IC1  45.72,13.49 0 top
IC2  57.61,62.83 270 top
IC3  50.29,39.29 180 top
IC4  27.23,28.57 90 top
IC5  76.89,57.73 270 top
JP1  92.96,64.8 270 top
JP2  47.14,54.78 0 bottom
JP3  37.34,31.65 270 bottom
JP5  45.09,67.94 270 top
L1  91.44,44.83 0 bottom
L2  85.09,47.22 180 top
L3  17.44,40.32 90 top
R1  33.83,31.28 90 top
R2  30.18,41.27 0 top
R3  28.93,39.24 180 top
R4  21.65,39.24 180 top
R5  20.42,41.17 0 top
R6  25.27,39.24 0 top
R7  31.95,35.22 90 top
R8  16.05,12.98 270 bottom
R9  54.33,52.28 0 top
R10  33.48,35.03 90 top
R11  16.21,20.75 270 bottom
R12  24.1,11.2 180 top
R13  19.74,16.99 90 top
R14  20.32,13.83 270 bottom
R17  18,23.29 0 top
R18  43.18,46.99 270 top
R19  18,25.83 180 top
R21  83.46,50.39 0 top
R22  88.44,52.98 0 top
R23  92.05,52.48 270 top
R24  95.96,51.46 180 top
R25  88.44,51.46 0 top
R26  98.9,44.8 90 top
R27  97.64,45.3 90 top
R28  84.25,40.55 270 top
R29  85.47,40.05 270 top
R30  101.02,40.42 180 bottom
R31  88.44,54.56 0 top
R32  96.44,54.56 180 top
R33  94.77,57.63 180 top
R34  88.43,57.66 180 top
R35  90.94,30.23 0 top
R36  79.38,45.07 270 top
RJ1  26.57,57.61 90 bottom
SV1  80.9,10.79 180 bottom
U1  0,19.68 90 bottom
U2  91.44,42.67 270 top
U$2  23.47,16.69 0 top
X2  58.34,27.65 90 top
X3  45.72,9.53 0 bottom
Y1  50.49,20.8 0 top
Y2  13.36,31.5 270 top
Y3  90.94,33.53 180 top

### Tracks (layer width: path | path; a pad name or v marks a point on that pad's centre or on a via)
3V  (via drill 0.6 pad 1.42, 0.6 pad 1.78)  (1 unrouted)
  Top 0.203: 47.09,33.86 IC3.55 47.09,29.82 46.23,28.96 C3.1 | 47.09,33.86 49.89,33.86 | 49.89,33.86 IC3.62 49.89,31.6 49.38,31.09 C4.1 | 44.86,36.09 IC3.46 41.71,36.09 40.56,34.94 C7.1 | 47.09,33.86 44.86,33.86 44.86,36.09 | 44.86,36.09 44.86,39.69 IC3.37 42.08,39.69 40.89,38.51 40.13,38.51 40.16,38.73 C8.1 | 49.89,33.86 55.73,33.86 55.73,38.49 | 55.73,38.49 IC3.86 65.13,38.49 C6.1 | 54.69,44.73 IC3.2 54.69,47.02 55.2,47.53 v56.69,47.53 | 49.09,44.73 IC3.16 49.09,47.46 C38.1 | 49.09,44.73 54.69,44.73 | 49.09,44.73 45.24,44.73 44.91,45.06 44.91,47.6 44.57,47.94 R18.1 | 55.73,38.49 55.73,43.69 54.69,44.73 | 79.4,43.17 79.38,43.15
  Top 0.251: U2.6 83.13,42.92 C40.1 | C42.1 91.69,36.47 U2.19 91.69,39.37 89.19,39.37 U2.14 89.19,37.55 88.61,36.97 C41.1 | 89.46,22.28 89.51,22.23 | R30.2 104.83,43.16 104.04,43.94 100.25,43.94 99.73,43.42 U2.32
  Top 0.305: U$2.3 24.11,8.91 24.13,8.89 | 78.11,43.14 78.11,43.15
  Top 0.406: 40.13,38.51 35.08,38.51 33.48,36.91 R10.2 | 33.47,35.87 R10.2 | R10.2 31.96,35.88 R7.2 | 17.74,14.86 18,14.61 | C40.1 79.38,43.15 78.11,43.15 v76.66,43.15 | C41.1 86.36,36.25 | C56.1 86.39,36.22 86.36,36.25 | 86.36,36.25 82.73,36.25 81.99,35.51 v81.99,33.5 | C15.+ 66.67,62.83
  Top 0.457: L3.1 17.92,39 17.97,39 C19.1 | IC4.P$15 C19.1 | C19.1 C25.1 IC4.P$19 21.51,34.42 21.51,33.77 | C32.1 18,30.16 18.36,30.52 IC4.P$25 21.51,30.52 21.51,33.77 | IC4.P$28 C18.1 | IC4.P$20 21.51,33.77
  Top 0.508: C32.1 C18.1 v18,19.58 | R13.2 C31.1
  Top 0.61: U$2.7 U$2.8 21.57,17.84 R13.2 | v18,19.58 C31.1 18,14.61 v18,12.13 | C11.1 v56.69,47.53 | v56.69,52.28 R9.2
  Top 0.813: R30.2 104.83,25.83 101.22,22.23 | IC2.2 C14.1
  Top 1.016: v18,12.13 18,10.58 19.68,8.89 24.13,8.89 v33.23,8.89 38.95,3.17 98.42,3.17 101.22,5.97 SV1.34 SV1.33 101.22,21.97 100.97,22.23 | 100.97,22.23 89.51,22.23 83.82,22.23 81.99,24.05 v81.99,33.5 | 100.97,22.23 101.22,22.23 | IC2.2 IC2.TAB 60.72,62.84 63.74,62.84 v63.75,62.83 66.67,62.83 74.1,62.83 v74.12,62.81
  Bottom 0.406: R11.2 16.19,19.9 15.88,19.59
  Bottom 0.457: C29.1 19.37,19.58 v18,19.58
  Bottom 0.61: U1.4 15.88,19.59 v17.99,19.59 v18,19.58 | R8.2 v18,12.13 19.47,12.13 R14.2 | v33.23,8.89 33.23,20.54 37.34,24.64 JP3.4 | v56.69,47.53 v56.69,52.28
  Bottom 0.813: v63.75,62.83 63.75,59.34 v56.69,52.28
  Bottom 1.016: v74.12,62.81 76.66,60.32 v76.66,43.15 76.66,36.17 79.32,33.5 v81.99,33.5
_2V6  (via drill 0.6 pad 1.42)
  Top 0.61: L2.2 v82.53,47.22
  Top 0.813: IC5.2
  Top 1.016: IC5.2 IC5.TAB | C54.1 IC5.2 | C51.+ IC5.TAB | IC5.TAB 79.98,49.76 v82.53,47.22
  Bottom 0.61: L1.2 89.28,44.83 86.89,47.22 v82.53,47.22
AN_3V
  Top 0.203: C9.1 41.14,43.64 42.29,42.49 IC3.30 44.86,42.49 44.86,44.37 44.53,44.7 43.38,44.7 43.18,44.91 R18.2
CE1
  Top 0.406: R12.2 22.1,11.2 21.57,11.73 U$2.1
  Top 0.61: R13.1 21.57,16.14 U$2.1
D2_N
  Top 0.406: IC1.1 44.77,9.57 X3.2
D2_P
  Top 0.406: IC1.3 46.67,9.57 X3.3
D_N
  Top 0.203: IC1.6 44.77,14.52 45.49,15.24 45.49,27.27 47.49,29.27 IC3.56
D_P
  Top 0.203: IC1.4 46.67,14.52 45.95,15.24 45.95,27.08 47.89,29.03 IC3.57
ENC_CS
  Top 0.203: IC4.P$9 33.66,33.77 | 33.66,33.77 34.31,33.77 34.59,34.06 34.59,36.78 35.56,37.74 40.84,37.74 42.39,39.29 IC3.38 | R10.1 33.48,33.95 33.66,33.77
  Top 0.254: IC4.P$9
ENC_RST
  Top 0.305: IC4.P$10 31.81,34.42 R7.1
FLASH_CS
  Top 0.203: R12.1 28.4,11.2 29.03,11.84 29.03,17.6 31.11,19.68 40.64,19.68 42.22,21.26 42.22,29.08 43.48,30.35 45.26,30.35 46.29,31.38 IC3.53
GND  (via drill 0.5 pad 1.27, 0.6 pad 1.02, 0.6 pad 1.42, 0.61 pad 1.42)
  Top 0.203: IC3.75 55.09,31.95 v57.13,31.95 | IC3.65 51.09,25.92 51.84,25.17 v51.84,24.26 | IC3.45 39.9,36.49 | IC3.31 40.66,42.09 C9.2 | C8.2 41.17,39.8 41.46,40.09 IC3.36 46.9,40.09 | IC3.15 49.49,48.35 48.88,48.96
  Top 0.251: U2.4 85.67,43.92 84.62,44.95 C45.2 | U2.20 92.19,39.37 92.66,39.37 | 92.66,39.37 93.19,39.37 U2.22 93.19,36.27 C42.2 | U2.21 92.69,39.34 92.66,39.37 | U2.16 90.19,37.48 89.91,37.2 C41.2
  Top 0.254: IC1.2 45.89,11.19 45.89,12.01 46.17,12.29 48.26,12.29
  Top 0.406: JP5.GND1 v43.78,63.01
  Top 0.457: IC4.P$11 25.73,35.08 | IC4.P$18 23.07,35.08 | IC4.P$21 18.36,33.12 | IC4.P$22 18.25,32.48 17.7,33.02 | IC4.P$2 29.32,29.23 v30.34,30.25
  other vias: 12.96,5.41 44.07,27.51 66.45,36.07 20.62,43.48 14.86,38.2 24.28,41.12 26.82,44.55 26.61,13.44 52.02,66.42 47.47,48.96 10.19,28.83 48.29,27.61 38.73,41.73 58.47,45.24 64.75,27.51 43.04,32.72 39.12,22.81 7.24,53.44 79.96,40.41 81.27,44.56 86.82,38.66 94.84,32.38 86.84,32.38 100.43,46.18 76.89,65.15 66.67,58.17 69.27,49.91 102.34,38.07
  pour Top (isolate 0.305, rank 2, no thermals): 0,0 0,68.58 109.86,68.58 109.86,0
  pour Bottom (isolate 0.305, no thermals): 0,68.58 0,0 109.86,0 109.86,68.58
LED
  Top 0.203: IC3.67 51.89,25.83 56.13,21.59 61.92,21.59 64.64,18.87 64.64,16.87 61.09,13.31 60.05,13.31 59.33,12.6 59.33,10.77 SV1.2
LEDA
  Top 0.406: IC4.P$27 21.51,29.23 21.51,26.52 20.83,25.83 R19.1
LEDB
  Top 0.406: IC4.P$26 22.4,29.88 22.4,25.02 20.68,23.29 R17.2
MCLR
  Top 0.203: IC3.13 C28.1
  Top 0.61: C28.1 R9.1 53.48,54.76 JP2.1
MISO  (via drill 0.6 pad 1.42)
  Top 0.203: IC3.49 42.64,34.89 39.27,31.52 39.27,29.87 38.51,29.11 36.04,29.11 34.9,30.25 34.9,30.96 34.59,31.28 33.01,31.28 32.46,31.82 IC4.P$6
  Top 0.305: U$2.2 22.84,16.1 23.8,17.07 25.86,17.07 26.64,17.86 v26.64,22.86 26.64,24.41 26.24,24.82 26.24,31.5 26.57,31.83 26.57,31.82 IC4.P$6
  Bottom 0.305: U1.7 20.32,16.29 | 20.32,16.29 21.57,16.29 26.64,21.36 v26.64,22.86 26.64,21.59 | R14.1 20.32,16.29
MOSI  (via drill 0.6 pad 1.42)
  Top 0.305: U$2.5 v25.38,24.03 25.38,31.65 26.2,32.48 IC4.P$7 33.48,32.48 R1.2
  Bottom 0.305: v25.38,24.03 23.62,24.03 20.34,20.75 14.37,20.75 U1.3
N$1
  cutout Top: 42.04,42.55 42.04,39.67 45.26,39.67 45.26,42.55
N$2
  Top 0.61: R3.2 28.08,41.09 28,41.09 C16.2 R2.1
N$5
  Top 0.203: IC3.50 42.95,34.49 39.78,31.32 39.78,27.86 38.58,26.67 36.09,26.67 35.41,27.36 35.41,28.91 33.88,30.43 R1.1
N$6
  Top 0.254: RJ1.P4 25.93,51.87 24.59,53.21 20.85,53.21 20.17,52.53 20.17,44.6 19.57,44.01 R5.1
  Top 0.61: R4.2 19.57,39.24 R5.1 L3.2 | L3.2 | C17.2 L3.2
N$8  (via drill 0.6 pad 1.27)
  other vias: 104.86,18.97
N$9  (via drill 0.6 pad 1.27)
  other vias: 104.86,63.58
N$10
  Top 0.203: IC3.85 63.26,38.09 C10.1
N$11  (via drill 0.6 pad 1.27)
  other vias: 5,63.58
N$12
  Top 0.406: IC4.P$14 26.78,37.02 26.22,37.58 R6.2
N$17
  Top 0.406: F1.1 46.73,63.33 46.38,63.67 JP5.VBUS1
N$18
  Top 0.406: C36.2 R23.1
N$22
  Top 0.305: IC4.P$23 12.22,31.82 | 12.22,31.82 11.43,31.82 10.8,32.46 C21.1 | Y2.1 12.21,31.83 12.22,31.82
N$23
  Top 0.305: IC4.P$24 14.53,31.18 | 14.53,31.18 11.44,31.18 10.8,30.54 C22.1 | Y2.3 14.51,31.16 14.53,31.18
N$29
  Top 0.457: IC4.P$1 30.19,28.57 C24.+
N$30
  Top 0.406: RJ1.Y+ 31.8,63.93 18.14,63.93 14.78,60.58 14.78,49.02 5.46,39.7 5.46,28.25 8.69,25.02 13.46,25.02 15.19,23.29 R17.1
N$31
  Top 0.406: R19.2 9.02,25.83 6.27,28.57 6.27,39.37 15.6,48.69 15.6,60.25 17.91,62.56 RJ1.G+
N$36  (via drill 0.6 pad 1.27)
  other vias: 5,5
OSC1
  Top 0.203: Y1.1 50.26,19.65 50.29,19.68 | C2.1 49.66,18.41 50.29,19.05 50.29,19.68 | IC3.63 50.29,19.68
OSC2
  Top 0.203: Y1.3 50.7,21.95 50.69,21.95 | C1.1 51.43,18.41 50.69,19.15 50.69,21.95 | IC3.64 50.69,21.95
PGEC
  Top 0.203: IC3.24 45.89,48.01 43.33,50.57 JP2.5
PGED
  Top 0.203: IC3.25 45.49,47.7 42.06,51.13 42.06,55.96 42.85,56.74 44.86,56.74 45.87,55.73 JP2.4
RA6
  Top 0.203: IC3.91 67.23,40.49 73.28,34.44 73.28,19.68 SV1.17
RA7
  Top 0.203: IC3.92 67.54,40.89 73.79,34.65 73.79,19.89 80.37,13.31 81.46,13.31 82.17,12.6 82.17,10.79 SV1.20
RD1
  Top 0.203: IC3.76 57.73,34.49 61.47,30.76 65.81,30.76 66.67,29.9 66.67,14.88 64.39,12.6 64.39,10.79 SV1.6
RD2
  Top 0.203: IC3.77 58.07,34.89 61.7,31.27 66.02,31.27 67.18,30.1 67.18,13.59 SV1.5
RD3
  Top 0.203: IC3.78 58.38,35.29 61.9,31.77 66.22,31.77 67.69,30.3 67.69,13.36 66.93,12.6 66.93,10.79 SV1.8
RD4
  Top 0.203: IC3.81 59.31,36.49 62.51,33.3 66.83,33.3 69.22,30.91 69.22,13.59 SV1.9
RD5
  Top 0.203: IC3.82 59.63,36.89 62.71,33.81 67.03,33.81 69.72,31.11 69.72,14.88 72.01,12.6 72.01,10.79 SV1.12
RD6
  Top 0.203: IC3.83 59.94,37.29 62.92,34.31 67.23,34.31 70.23,31.32 70.23,15.11 SV1.11
RD7
  Top 0.203: IC3.84 60.25,37.69 63.12,34.82 67.44,34.82 70.74,31.52 70.74,16.41 74.55,12.6 74.55,10.79 SV1.14
RD8
  Top 0.203: IC3.68 52.29,26.14 56.34,22.1 62.13,22.1 65.15,19.07 65.15,16.64 SV1.1
RD9
  Top 0.203: IC3.69 52.69,26.45 56.54,22.61 62.33,22.61 65.66,19.28 65.66,16.41 61.85,12.6 61.85,10.79 SV1.4
RD11
  Top 0.203: IC3.71 53.49,27.08 56.95,23.62 64.49,23.62 66.17,21.95 66.17,15.11 SV1.3
RD12
  Top 0.203: IC3.79 58.69,35.69 62.1,32.28 66.42,32.28 68.2,30.5 SV1.7
RD13
  Top 0.203: IC3.80 59,36.09 62.31,32.79 66.62,32.79 68.71,30.71 68.71,13.36 69.47,12.6 69.47,10.79 SV1.10
RE0
  Top 0.203: IC3.93 67.85,41.29 74.3,34.85 74.3,20.09 80.57,13.82 81.69,13.82 SV1.19
RE1
  Top 0.203: IC3.94 68.16,41.69 74.8,35.05 74.8,20.3 80.77,14.33 81.89,14.33 82.91,13.31 84,13.31 84.71,12.6 84.71,10.79 SV1.22
RE2
  Top 0.203: IC3.98 69.41,43.29 76.83,35.87 76.83,21.11 81.58,16.36 82.7,16.36 83.72,15.34 84.84,15.34 85.85,14.33 86.97,14.33 87.99,13.31 89.08,13.31 89.79,12.6 89.79,10.79 SV1.26
RE3
  Top 0.203: IC3.99 69.72,43.69 77.34,36.07 77.34,21.31 81.79,16.87 82.91,16.87 83.92,15.85 85.04,15.85 86.06,14.83 87.17,14.83 88.19,13.82 89.31,13.82 SV1.25
RE4
  Top 0.203: IC3.100 70.03,44.09 77.85,36.27 77.85,21.51 81.99,17.37 83.11,17.37 84.12,16.36 85.24,16.36 86.26,15.34 87.38,15.34 88.39,14.33 89.51,14.33 90.53,13.31 91.62,13.31 92.33,12.6 92.33,10.79 SV1.28
RE5
  Top 0.203: IC3.3 54.29,47.59 55.35,48.64 58.57,48.64 62.61,44.6 70.23,44.6 78.36,36.47 78.36,21.72 82.19,17.88 83.31,17.88 84.33,16.87 85.45,16.87 86.46,15.85 87.58,15.85 88.59,14.83 89.71,14.83 90.73,13.82 91.85,13.82 SV1.27
RF0
  Top 0.203: IC3.87 65.98,38.89 71.25,33.63 71.25,16.64 SV1.13
RF1
  Top 0.203: IC3.88 66.29,39.29 71.75,33.83 71.75,17.93 77.09,12.6 77.09,10.79 SV1.16
RG0
  Top 0.203: IC3.90 66.92,40.09 72.77,34.24 72.77,19.46 79.63,12.6 79.63,10.79 SV1.18
RG1
  Top 0.203: IC3.89 66.61,39.69 72.26,34.04 72.26,18.16 SV1.15
RG12
  Top 0.203: IC3.96 68.78,42.49 75.82,35.46 75.82,20.7 81.18,15.34 82.3,15.34 83.31,14.33 84.43,14.33 85.45,13.31 86.54,13.31 87.25,12.6 87.25,10.79 SV1.24
RG13
  Top 0.203: IC3.97 69.09,42.89 76.33,35.66 76.33,20.9 81.38,15.85 82.5,15.85 83.52,14.83 84.63,14.83 85.65,13.82 86.77,13.82 SV1.23
RG14
  Top 0.203: IC3.95 68.47,42.09 75.31,35.26 75.31,20.5 80.97,14.83 82.09,14.83 83.11,13.82 84.23,13.82 SV1.21
RXD
  Top 0.203: IC3.47 42.02,35.69 40.51,34.19 36.2,34.19 35.41,33.4 35.41,30.63 35.66,30.38 JP3.3
SCK  (via drill 0.6 pad 1.42)
  Top 0.203: IC4.P$8 34.4,33.12 35.1,33.83 35.1,36.58 35.75,37.22 41.03,37.22 42.7,38.89 IC3.39
  Top 0.305: IC4.P$8 25.84,33.12 24.11,31.39 v24.11,22.86 U$2.6
  Bottom 0.305: U1.5 14.37,18.41 21.57,18.41 24.11,20.95 v24.11,22.86
SD_CS  (via drill 0.6 pad 1.42)
  Top 0.203: IC3.51 45.49,31.95 44.91,31.37 43.08,31.37 41.2,29.49 41.2,26.59 39.8,25.2 v27.53,25.2
  Bottom 0.305: U1.2 15.88,21.79 20.52,21.79 23.93,25.2 v27.53,25.2
  Bottom 0.406: R11.1 16.06,21.6 15.88,21.79
SD_PRESENT  (via drill 0.6 pad 1.42)
  Top 0.203: v30,20.19 40.44,20.19 41.71,21.46 41.71,29.29 43.28,30.86 45.06,30.86 45.89,31.69 IC3.52
  Bottom 0.305: R8.1 23.63,13.83 v30,20.19
  Bottom 0.61: U1.CD1 R8.1
SOSCI
  Top 0.203: X2.1 56.63,26.4 54.29,28.74 IC3.73
  Top 0.406: X2.1 C20.2
SOSCO
  Top 0.203: IC3.74 54.69,30.4 56.19,28.9 X2.2
  Top 0.406: X2.2 C23.2
TPIN_N
  Top 0.254: IC4.P$12 29.62,35.73 30.63,36.73 30.63,41.3 | RJ1.RD- 30.63,46.56 30.63,46.18 arc90 31.01,45.8 31.93,45.8 arc-90 32.31,45.41 32.31,45.37 arc-90 31.93,44.99 31.01,44.99 arc90 30.63,44.61 30.63,44.56 arc90 31.01,44.18 31.93,44.18 arc-90 32.31,43.8 32.31,43.76 arc-90 31.93,43.38 31.01,43.38 arc90 30.63,42.99 30.63,41.3 | R2.2 30.66,41.27 30.63,41.3
TPIN_P
  Top 0.254: IC4.P$13 29.63,36.38 30.18,36.92 30.18,39.55 | 30.18,39.55 30.18,46.38 29.13,47.42 25.4,47.42 24.66,48.16 RJ1.RD+ | R3.1 29.87,39.24 30.18,39.55
TPOUT_N
  Top 0.254: R5.2 21.67,41.17 | 21.67,41.17 21.67,49.38 20.83,50.22 20.83,52.25 21.13,52.55 23.11,52.55 23.39,52.27 RJ1.TD- | 21.67,41.17 21.67,36.75 21.29,36.38 IC4.P$16
TPOUT_P
  Top 0.254: 22.12,39.14 22.12,36.56 21.29,35.73 IC4.P$17 | R4.1 22.12,39.14 | 22.12,39.14 22.12,43.02 arc-90 22.5,43.41 23.79,43.41 arc90 24.17,43.79 24.17,43.8 arc90 23.79,44.18 22.5,44.18 arc-90 22.12,44.56 22.12,44.57 arc-90 22.5,44.95 23.79,44.95 arc90 24.17,45.33 24.17,45.34 arc90 23.79,45.72 22.5,45.72 arc-90 22.12,46.1 RJ1.TD+
TXD
  Top 0.203: IC3.48 42.33,35.29 39.95,32.92 JP3.2
VBUS  (via drill 0.6 pad 1.42)
  Top 0.203: 42.73,12.29 42.73,28.89 43.69,29.84 45.47,29.84 46.69,31.07 IC3.54
  Top 0.254: IC1.5 45.55,13.49 45.55,12.58 45.26,12.29 42.73,12.29
  Top 0.305: C5.+ 51.43,6.35 51.44,5.71
  Top 0.406: X3.1 42.22,11.79 42.73,12.29 | C13.1 52.06,60.52 52.07,60.52
  Top 0.61: 52.07,60.52 F1.2 C12.+ | C30.+ 98.68,15.24
  Top 0.813: 51.44,5.71 C5.+ | C5.+ 43.18,5.71 42.22,6.68 C27.1 X3.1 | C5.+ | 52.07,60.52 54.5,60.52 IC2.3 | IC5.3 | C53.1 71.12,55.43 | C53.1 | IC5.3
  Top 1.016: IC2.3 56.33,60.52 61.42,55.42 C52.+ C53.1 IC5.3 | v78.31,48.46 78.31,52.55 75.44,55.42 IC5.3 | v80.47,35.46 80.47,23.04 83.19,20.32 98.68,20.32 98.68,15.24 SV1.31 SV1.32 98.68,7.24 97.15,5.71 C5.+
  Bottom 1.016: v78.31,48.46 78.31,37.62 v80.47,35.46
VS_AGND
  Top 0.251: U2.47 89.19,47.56 87.59,49.16 C35.2 | U2.41 92.19,47.87 92.58,47.87 92.69,47.75 | U2.40 92.69,47.75 | 92.69,47.75 92.69,49.74 C34.2 | U2.37 94.19,47.58 95.38,48.77 98.17,48.77 98.49,49.09 C33.2
  Top 0.406: C35.2 R25.1 84.34,51.46 C39.1 | C37.1 C33.2 | 92.96,62.43 92.89,62.36 | 84.44,55.91 84.34,56.01 | C34.2 93.92,50.97 R33.2
  Top 0.61: 91.44,62.36 92.89,62.36 98.55,62.36 99.82,61.09 99.82,58.67 98.49,57.34 C37.1 | 91.44,62.36 85.72,62.36 84.34,60.97 84.34,57.66 | JP1.SLEEVE 92.96,62.43 | C39.1 84.34,56.01 84.34,57.66 | 91.44,62.36 91.44,59.18 92.05,58.57 C36.1 R33.2 | R34.2 84.34,57.66
  pour Top (isolate 0.305, no thermals): 83.82,68.71 83.82,49.53 101.73,49.53 101.73,60.58 100.33,61.98 100.33,68.71
VS_AVDD  (via drill 0.6 pad 1.42)
  Top 0.251: C35.1 89.29,49.16 90.19,48.27 U2.45 90.19,45.97 91.19,45.97 | C34.1 91.19,49.3 U2.43 91.19,45.97 | C33.1 95.44,49.95 93.69,48.2 U2.38 93.69,45.97 | 93.69,45.97 91.19,45.97 | 93.69,45.97 94.77,45.97 v95.63,46.84
  Top 0.406: v95.63,46.84 96.93,48.13 100.19,48.13 C58.1
  Bottom 0.61: L1.1 93.62,44.83 v95.63,46.84
VS_CVDD
  Top 0.251: C45.1 84.35,43.42 U2.5 88.21,43.42 | 88.21,43.42 88.21,45.9 | 94.19,42.42 U2.24 94.19,37.26 C48.1 | 94.19,42.42 94.69,42.92 U2.31 C47.1 | 88.21,43.42 88.21,42.42 | 88.21,42.42 94.19,42.42 | 88.21,42.42 U2.7 81.88,42.42 C46.1
  Top 0.254: 88.21,45.9 86.89,47.22 L2.1
  Top 0.61: C47.1 C57.1
VS_DREQ
  Top 0.203: U2.8 83.32,41.92 82.8,41.4 82.8,39.73 82.19,39.12 77.85,39.12 70.84,46.13 63.22,46.13 59.18,50.16 54.74,50.16 53.09,48.52 IC3.6
VS_MISO  (via drill 0.6 pad 1.42)
  Top 0.203: IC3.9 51.89,48.74 54.33,51.18 59.59,51.18 63.63,47.14 v74.02,47.14
  Top 0.251: 100.1,40.06 100.1,40.59 98.27,42.42 97.73,42.42 | 84.71,26.98 84.71,25.7 | 91.44,26.04 88.9,26.04
  Top 0.254: 97.08,42.42 U2.30 97.73,42.42 | 100.1,40.06 100.1,29.16 96.98,26.04 91.44,26.04 | v84.71,29.64 84.71,26.98 | 84.71,25.7 84.71,25.43 85.42,24.71 86.39,24.71 86.79,25.12 87.58,25.12 88.49,26.04 88.9,26.04
  Bottom 0.406: v74.02,47.14 74.02,35.43 79.81,29.64 v84.71,29.64
VS_MOSI  (via drill 0.6 pad 1.42)
  Top 0.203: IC3.72 53.89,27.39 57.15,24.13 v65.56,24.13
  Top 0.251: 99.54,39.83 99.54,40.36 97.98,41.92 97.45,41.92
  Top 0.254: U2.29 97.45,41.92 | 99.54,39.83 99.54,29.39 96.75,26.59 88.19,26.59 87.45,25.86 v85.9,25.86
  Bottom 0.406: v65.56,24.13 85.24,24.13 85.88,24.77 v85.9,25.86
VS_N$9
  Top 0.251: U2.18 91.19,34.61 | 91.19,34.61 91.19,31.77 91.79,31.17 R35.2 | Y3.1 91.26,34.68 91.19,34.61
  Top 0.61: R35.2 C50.1
VS_N$13
  Top 0.251: U2.17 90.69,32.38 | 90.69,32.38 90.69,31.74 90.09,31.14 R35.1 | Y3.3 90.69,32.38
  Top 0.254: R35.1 90.09,30.13
  Top 0.61: R35.1 C49.1
VS_N$14
  Top 0.251: U2.46 89.69,47.9 88.44,49.15 88.44,52.09 89.29,52.95 R22.2
  Top 0.406: R22.2 R31.2
VS_N$15
  Top 0.251: U2.42 91.69,48.74 92.05,49.1 R23.2
VS_N$16
  Top 0.251: U2.39 93.19,48.51 95.11,50.43 R24.2
  Top 0.406: R24.2 95.11,52.62 95.61,53.11 95.61,54.56 R32.2
VS_N$17
  Top 0.251: U2.44 90.69,48.48 90.25,48.92 90.25,51.09 89.29,51.09 R25.2
VS_N$24
  Top 0.305: 96.79,52.02 R24.1
  Top 0.406: C37.2 96.79,52.02
VS_N$25
  Top 0.406: C39.2 R22.1
VS_N$26
  Top 0.251: U2.10 86.29,40.92 85.69,40.92 R29.1
VS_N$27
  Top 0.251: U2.9 84.47,41.42 R28.1
VS_N$28
  Top 0.251: U2.34 97.41,44.42 R27.1
VS_N$30
  Top 0.251: U2.33 98.68,43.92 R26.1
VS_N$34
  Top 0.251: U2.26 R30.1
VS_N$35
  Top 0.406: R31.1 C43.1
VS_N$36
  Top 0.406: R32.1 C44.1
VS_N$37
  Top 0.61: JP1.RING 96.5,59.8 95.62,58.91 R33.1 95.59,57.61 C44.2
VS_N$38
  Top 0.406: C43.2 89.29,57.65 R34.1
  Top 0.61: 89.29,57.65 89.29,58.79 88.29,59.8 JP1.TIP
VS_SCK  (via drill 0.6 pad 1.42)
  Top 0.203: IC3.70 53.09,26.77 56.74,23.11 63.4,23.11 v64.92,21.59
  Top 0.251: 98.98,39.6 98.98,40.13 97.69,41.42 97.16,41.42 | 90.91,27.15 v87.12,27.15
  Top 0.254: U2.28 97.16,41.42 | 98.98,39.6 98.98,29.62 96.52,27.15 90.91,27.15
  Bottom 0.406: v64.92,21.59 66.75,23.42 85.55,23.42 87.12,24.99 v87.12,27.15
VS_XCS
  Top 0.203: 88.11,39.37 88.11,38.05 87.4,37.34 78.92,37.34 70.64,45.62 63.02,45.62 58.98,49.66 54.94,49.66 53.49,48.21 IC3.5
  Top 0.254: U2.23 93.69,39.76 93.42,40.03 88.77,40.03 88.11,39.37
VS_XDCS
  Top 0.203: 88.69,37.84 87.68,36.83 78.72,36.83 70.43,45.11 62.81,45.11 58.78,49.15 55.14,49.15 53.89,47.9 IC3.4
  Top 0.254: U2.13 88.69,37.84
VS_XRST
  Top 0.203: IC3.7 52.69,48.83 54.53,50.67 59.38,50.67 63.42,46.63 72.95,46.63 73.74,45.85 79.3,45.85 R36.1 79.38,45.82 84.71,45.82 86.08,44.45 87.16,44.45 U2.3